# EAGLE design SWARMESH04 (EAGLE 9.2.0)
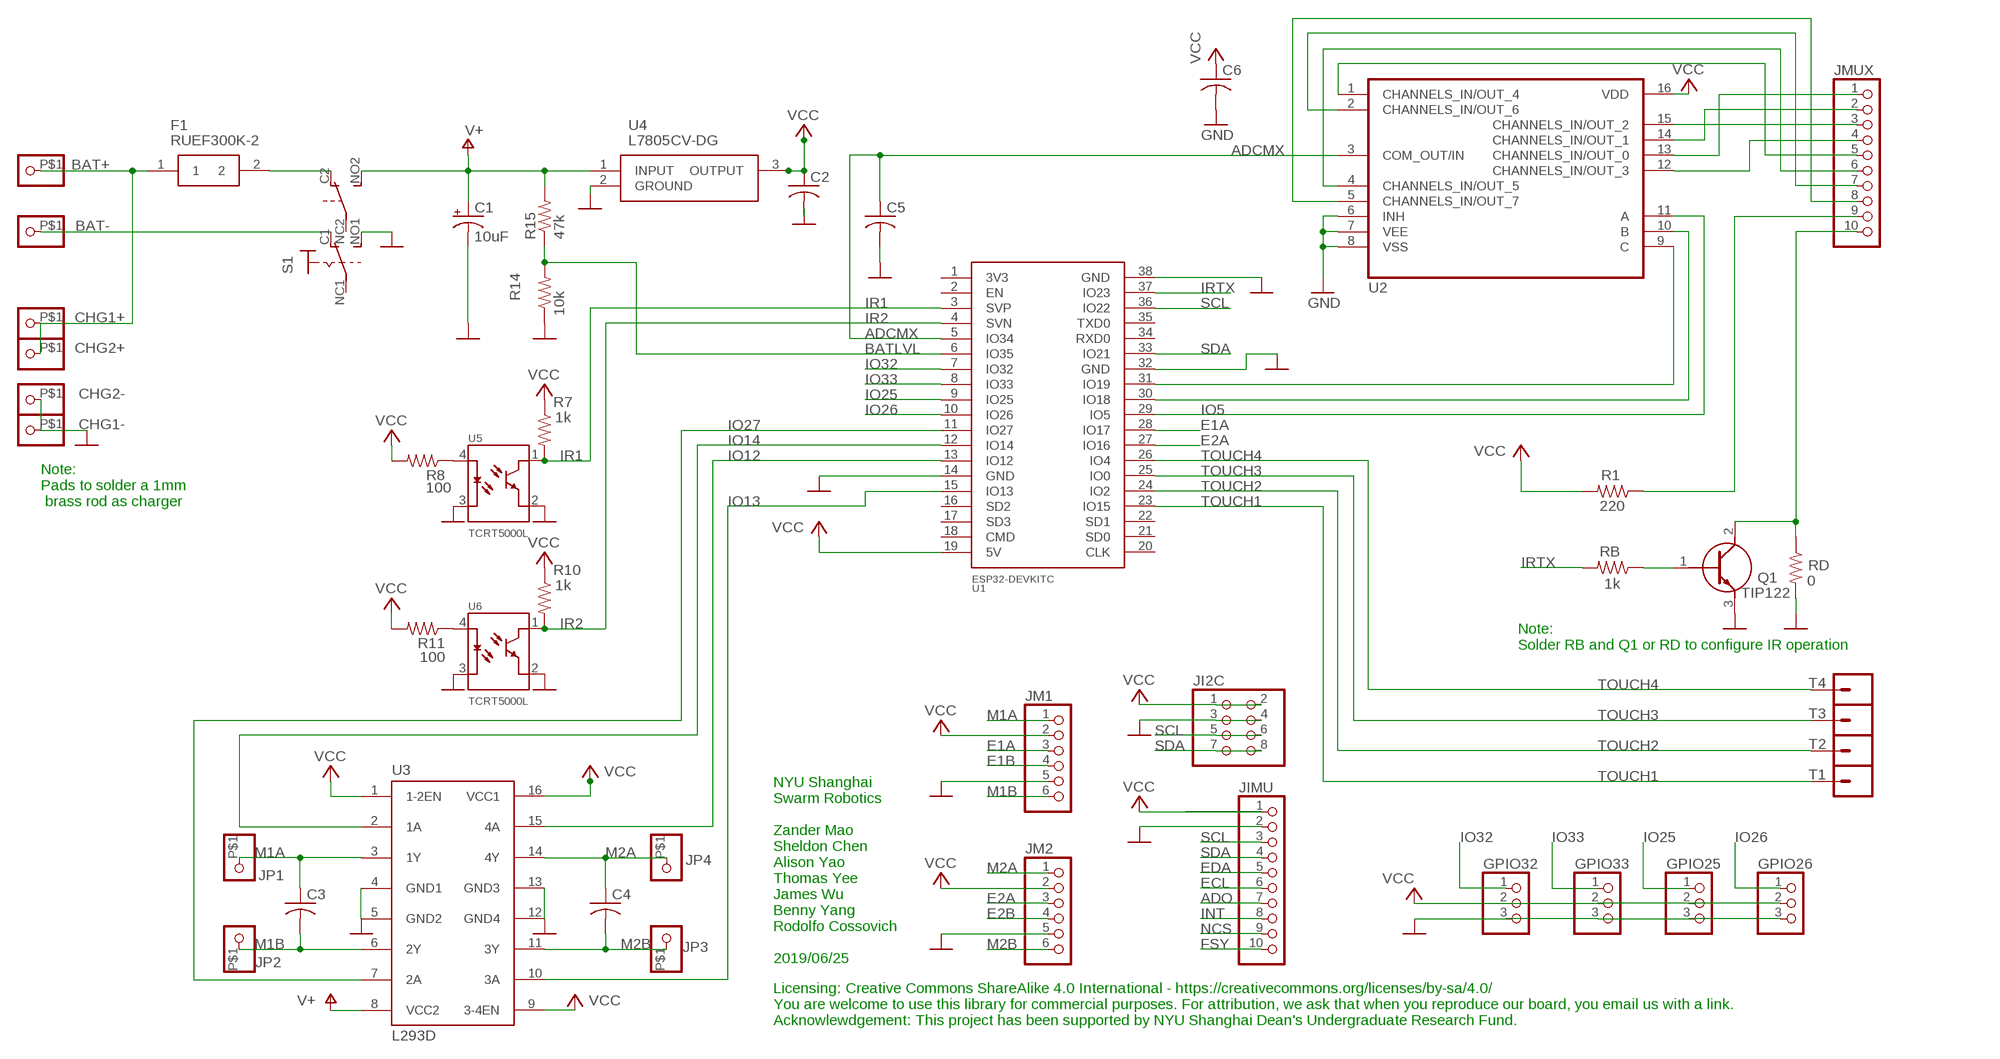
[diagram p0: schematic, sheet 1]

## Parts
BAT+  PINHD-1X1-BIGPOGO  [1X1-BIGPOGO]
BAT-  PINHD-1X1-BIGPOGO  [1X1-BIGPOGO]
C1  10uF  CPOL-USE2-5  [E2-5]
C2  C-US025-030X050  [C025-030X050]
C3  C-US025-025X050  [C025-025X050]
C4  C-US025-025X050  [C025-025X050]
C5  C-US025-030X050  [C025-030X050]
C6  C-US025-025X050  [C025-025X050]
CHG1+  PINHD-1X1-BIGPOGO  [1X1-BIGPOGO]
CHG1-  PINHD-1X1-BIGPOGO  [1X1-BIGPOGO]
CHG2+  PINHD-1X1-BIGPOGO  [1X1-BIGPOGO]
CHG2-  PINHD-1X1-BIGPOGO  [1X1-BIGPOGO]
F1  RUEF300K-2  [RUEF300K2]
GPIO25  PINHD-1X3  [1X03]
GPIO26  PINHD-1X3  [1X03]
GPIO32  PINHD-1X3  [1X03]
GPIO33  PINHD-1X3  [1X03]
JI2C  PINHD-2X4  [2X04]
JIMU  PINHD-1X10  [1X10-BIG]
JM1  PINHD-1X6  [1X06]
JM2  PINHD-1X6  [1X06]
JMUX  PINHD-1X10  [1X10-BIG]
JP1  PINHD-1X1-BIGPOGO  [1X1-BIGPOGO]
JP2  PINHD-1X1-BIGPOGO  [1X1-BIGPOGO]
JP3  PINHD-1X1-BIGPOGO  [1X1-BIGPOGO]
JP4  PINHD-1X1-BIGPOGO  [1X1-BIGPOGO]
Q1  TIP122  [TO270P460X1020X2008-3P]
R1  220  R-US_0207/9  [0207/9]
R7  1k  R-US_0207/9  [0207/9]
R8  100  R-US_0207/9  [0207/9]
R10  1k  R-US_0207/9  [0207/9]
R11  100  R-US_0207/9  [0207/9]
R14  10k  R-US_0207/9  [0207/9]
R15  47k  R-US_0207/9  [0207/9]
RB  1k  R-US_0207/9  [0207/9]
RD  0  R-US_0207/9  [0207/9]
S1  SWITCH_320-938  [PS22F03]
T1  CONN_01SPRING-CONN  [SPRING-CONNECTOR]
T2  CONN_01SPRING-CONN  [SPRING-CONNECTOR]
T3  CONN_01SPRING-CONN  [SPRING-CONNECTOR]
T4  CONN_01SPRING-CONN  [SPRING-CONNECTOR]
U1  ESP32DEVKITC  [ESP32-DEVKITC]
U2  CD4051BEE4  [CD4051BEE4DIP]
U3  L293D  [DIL16]
U4  L7805CV-DG  [TO270P460X1020X2008-3P]
U5  TCRT5000L  [XDCR_TCRT5000L]
U6  TCRT5000L  [XDCR_TCRT5000L]

## Nets
ADCMX: C5.1 U1.5(IO34) U2.3(COM_OUT/IN)
ADO: JIMU.7
BATLVL: R14.2 R15.1 U1.6(IO35)
E1A: JM1.3 U1.28(IO17)
E1B: JM1.4
E2A: JM2.3 U1.27(IO16)
E2B: JM2.4
ECL: JIMU.6
EDA: JIMU.5
FSY: JIMU.10
GND: C1.- C2.2 C5.2 C6.2 CHG1-.P$1 CHG2-.P$1 GPIO25.3 GPIO26.3 GPIO32.3 GPIO33.3 JI2C.3 JI2C.4 JIMU.2 JM1.5 JM2.5 Q1.3(E) R14.1 RD.2 S1.NO1(1:S) U1.14(GND) U1.32(GND) U1.38(GND) U2.6(INH) U2.7(VEE) U2.8(VSS) U3.4(GND1) U3.5(GND2) U3.12(GND4) U3.13(GND3) U4.2(GROUND) U5.2(E) U5.3(C) U6.2(E) U6.3(C)
INT: JIMU.8
IO5: U1.29(IO5) U2.11(A)
IO12: U1.13(IO12) U3.15(4A)
IO13: U1.15(IO13) U3.10(3A)
IO14: U1.12(IO14) U3.2(1A)
IO25: GPIO25.1 U1.9(IO25)
IO26: GPIO26.1 U1.10(IO26)
IO27: U1.11(IO27) U3.7(2A)
IO32: GPIO32.1 U1.7(IO32)
IO33: GPIO33.1 U1.8(IO33)
IR1: R7.2 U1.3(SVP) U5.1(CO)
IR2: R10.2 U1.4(SVN) U6.1(CO)
IRTX: RB.2 U1.37(IO23)
M1A: C3.1 JM1.1 JP1.P$1 U3.3(1Y)
M1B: C3.2 JM1.6 JP2.P$1 U3.6(2Y)
M2A: C4.1 JM2.1 JP4.P$1 U3.14(4Y)
M2B: C4.2 JM2.6 JP3.P$1 U3.11(3Y)
N$1: Q1.1(B) RB.1
N$2: F1.2 S1.C2(B:O)
N$3: BAT-.P$1 S1.C1(1:O)
N$5: JMUX.6 U2.4(CHANNELS_IN/OUT_5)
N$7: U1.30(IO18) U2.10(B)
N$8: U1.31(IO19) U2.9(C)
N$9: R11.1 U6.4(A)
N$10: R8.1 U5.4(A)
N$11: JMUX.5 U2.1(CHANNELS_IN/OUT_4)
N$13: JMUX.7 U2.2(CHANNELS_IN/OUT_6)
N$14: JMUX.8 U2.5(CHANNELS_IN/OUT_7)
N$15: BAT+.P$1 CHG1+.P$1 CHG2+.P$1 F1.1
N$16: JMUX.9 R1.1
N$17: JMUX.10 Q1.2(C) RD.1
N$19: JMUX.1 U2.13(CHANNELS_IN/OUT_0)
N$20: JMUX.2 U2.14(CHANNELS_IN/OUT_1)
N$21: JMUX.4 U2.12(CHANNELS_IN/OUT_3)
N$22: JMUX.3 U2.15(CHANNELS_IN/OUT_2)
NCS: JIMU.9
SCL: JI2C.5 JI2C.6 JIMU.3 U1.36(IO22)
SDA: JI2C.7 JI2C.8 JIMU.4 U1.33(IO21)
TOUCH1: T1.P$2 U1.23(IO15)
TOUCH2: T2.P$2 U1.24(IO2)
TOUCH3: T3.P$2 U1.25(IO0)
TOUCH4: T4.P$2 U1.26(IO4)
V+: C1.+ R15.2 S1.NO2(B:S) U3.8(VCC2) U4.1(INPUT)
VCC: C2.1 C6.1 GPIO25.2 GPIO26.2 GPIO32.2 GPIO33.2 JI2C.1 JI2C.2 JIMU.1 JM1.2 JM2.2 R1.2 R7.1 R8.2 R10.1 R11.2 U1.19(5V) U2.16(VDD) U3.1(1-2EN) U3.9(3-4EN) U3.16(VCC1) U4.3(OUTPUT)
Unconnected: S1.NC1(1:P) S1.NC2(B:P) U1.1(3V3) U1.2(EN) U1.16(SD2) U1.17(SD3) U1.18(CMD) U1.20(CLK) U1.21(SD0) U1.22(SD1) U1.34(RXD0) U1.35(TXD0)

## Notes on the sheet
- Note:
  Pads to solder a 1mm
   brass rod as charger
- Note:
  Solder RB and Q1 or RD to configure IR operation
- NYU Shanghai
  Swarm Robotics
  
  Zander Mao
  Sheldon Chen
  Alison Yao
  Thomas Yee
  James Wu
  Benny Yang
  Rodolfo Cossovich
  
  2019/06/25
- Licensing: Creative Commons ShareAlike 4.0 International - https://creativecommons.org/licenses/by-sa/4.0/ 
  You are welcome to use this library for commercial purposes. For attribution, we ask that when you reproduce our board, you email us with a link.
  Acknowlewdgement: This project has been supported by NYU Shanghai Dean's Undergraduate Research Fund.

## Library data of the parts
BAT+ BAT- CHG1+ CHG1- CHG2+ CHG2- JP1-JP4 = adafruit:PINHD-1X1: Pin header 1x1 for 0.1" spacing With round pins
C1 = adafruit:CPOL-US: POLARIZED CAPACITOR, American symbol
C2-C6 = adafruit:C-US: CAPACITOR, American symbol
F1 = RUEF300K-2:RUEF300K-2: TE CONNECTIVITY / RAYCHEM - RUEF300K-2 - RESETTABLE FUSE, PTC, 30V, 3A, RADIAL Source: Datasheet <http://www.farnell.com/datasheets/1482689.pdf>; DESCRIPTION: TE CONNECTIVITY / RAYCHEM - RUEF300K-2 - RESETTABLE FUSE, PTC, 30V, 3A, RADIAL; HEIGHT: 16.5mm; MANUFACTURER_NAME: TE CONNECTIVITY / RAYCHEM; MANUFACTURER_PART_NUMBER: RUEF300K-2
GPIO25 GPIO26 GPIO32 GPIO33 = adafruit:PINHD-1X3: PIN HEADER
JI2C = adafruit:PINHD-2X4: PIN HEADER
JIMU JMUX = adafruit:PINHD-1X10: Pin header 1x10 0.1" spacing With round pins
JM1 JM2 = adafruit:PINHD-1X6: PIN HEADER
Q1 = TIP122:TIP122: TIP122, Darlington Transistor, NPN 8 A 100 V HFE:1000, 3-Pin, TO-220 Source: Datasheet <https://componentsearchengine.com/Datasheets/1/TIP122.pdf>; DESCRIPTION: TIP122, Darlington Transistor, NPN 8 A 100 V HFE:1000, 3-Pin, TO-220; HEIGHT: 4.6mm; MANUFACTURER_NAME: STMicroelectronics; MANUFACTURER_PART_NUMBER: TIP122; MOUSER_PART_NUMBER: 511-TIP122; MOUSER_PRICE-STOCK: https://www.mouser.com/Search/Refine.aspx?Keyword=511-TIP122
R1 R7 R8 R10 R11 R14 R15 RB RD = adafruit:R-US_: RESISTOR, American symbol
S1 = ArduinoNano LearningBot 4-21-18:SWITCH_320-938: TOGGLE SWITCH distributor RS Components
T1-T4 = SparkFun-Connectors:CONN_01: Single connection point. Often used as Generic Header-pin footprint for 0.1 inch spaced/style header connections On any of the 0.1 inch spaced packages, you can populate with these: Break Away Headers - Straight <https://www.sparkfun.com/products/116> (PRT-00116) Break Away Male Headers - Right Angle <https://www.sparkfun.com/products/553> (PRT-00553) Female Headers <https://www.sparkfun.com/products/115> (PRT-00115) Break Away Headers - Machine Pin <https://www.sparkfun.com/products/117> (PRT-00117) Break Away Female Headers - Swiss Machine Pin <https://www.sparkfun.com/products/743> (PRT-00743) This device is also useful as a general connection point to wire up your design to another part of your project. Our various solder wires solder well into these plated through hole pads. Hook-Up Wire - Assortment (Stranded, 22 AWG) <https://www.sparkfun.com/products/11375> (PRT-11375) Hook-Up Wire - Assortment (Solid Core, 22 AWG) <https://www.sparkfun.com/products/11367> (PRT-11367) View the entire wire category on our website here <https://www.sparkfun.com/categories/141> Special notes: SMTSO-256-ET is a "flush mount" nut for a 4-40 screw. We mostly use this on specialty testbeds; it is a nice way to connect hardware to your PCB at an adjustable hieght. Also note, the SNAP packages are for using a snappable style connector. We sell a baggie of snaps and they are also used on two LilyPad designs: Snap Assortment - 30 pack (male and female) <https://www.sparkfun.com/products/11347> (DEV-11347) LilyPad Arduino SimpleSnap <https://www.sparkfun.com/products/10941> (DEV-10941) LilyPad SimpleSnap Protoboard <https://www.sparkfun.com/products/10940> (DEV-10940); SF_ID: PRT-11822
U1 = ESP32-DEVKITC (1):ESP32DEVKITC
U2 = CD4051BEE4:CD4051BEE4: Multiplexer 8pin ADC/DAC
U3 = st-microelectronics:L293D: PUSH-PULL 4 CHANNEL DRIVER; MPN: L293D; OC_FARNELL: 9589619; OC_NEWARK: 56P8249
U4 = L7805CV-DG:L7805CV-DG: Voltage Regulator 5V 4% 1.5A TO220 L7805CV-DG, Linear Voltage Regulator, Current Limit, Shut-Down 1.5A 5 V, 3-Pin TO220 Source: Datasheet <http://www.st.com/web/en/resource/technical/document/datasheet/CD00000444.pdf>; ALLIED_NUMBER: 70390055; ALLIED_PRICE-STOCK: http://www.alliedelec.com/stmicroelectronics-l7805cv-dg/70390055/; DESCRIPTION: Voltage Regulator 5V 4% 1.5A TO220 L7805CV-DG, Linear Voltage Regulator, Current Limit, Shut-Down 1.5A 5 V, 3-Pin TO220; HEIGHT: 4.6mm; MANUFACTURER_NAME: STMicroelectronics; MANUFACTURER_PART_NUMBER: L7805CV-DG; MOUSER_PART_NUMBER: 511-L7805CV-DG; MOUSER_PRICE-STOCK: https://www.mouser.com/Search/Refine.aspx?Keyword=511-L7805CV-DG; RS_PART_NUMBER: 7931346P; RS_PRICE-STOCK: http://uk.rs-online.com/web/p/products/7931346P
U5 U6 = TCRT5000L:TCRT5000L: TCRT5000 Series 940 nm 100 mA 60 mA Transistor Output Reflective Optical Sensor; AVAILABILITY: Unavailable; DESCRIPTION: TCRT5000 Series 940 nm 100 mA 60 mA Transistor Output Reflective Optical Sensor; MF: Vishay Semiconductor; MP: TCRT5000L; PACKAGE: PCB Mount Vishay; PRICE: None

## Board
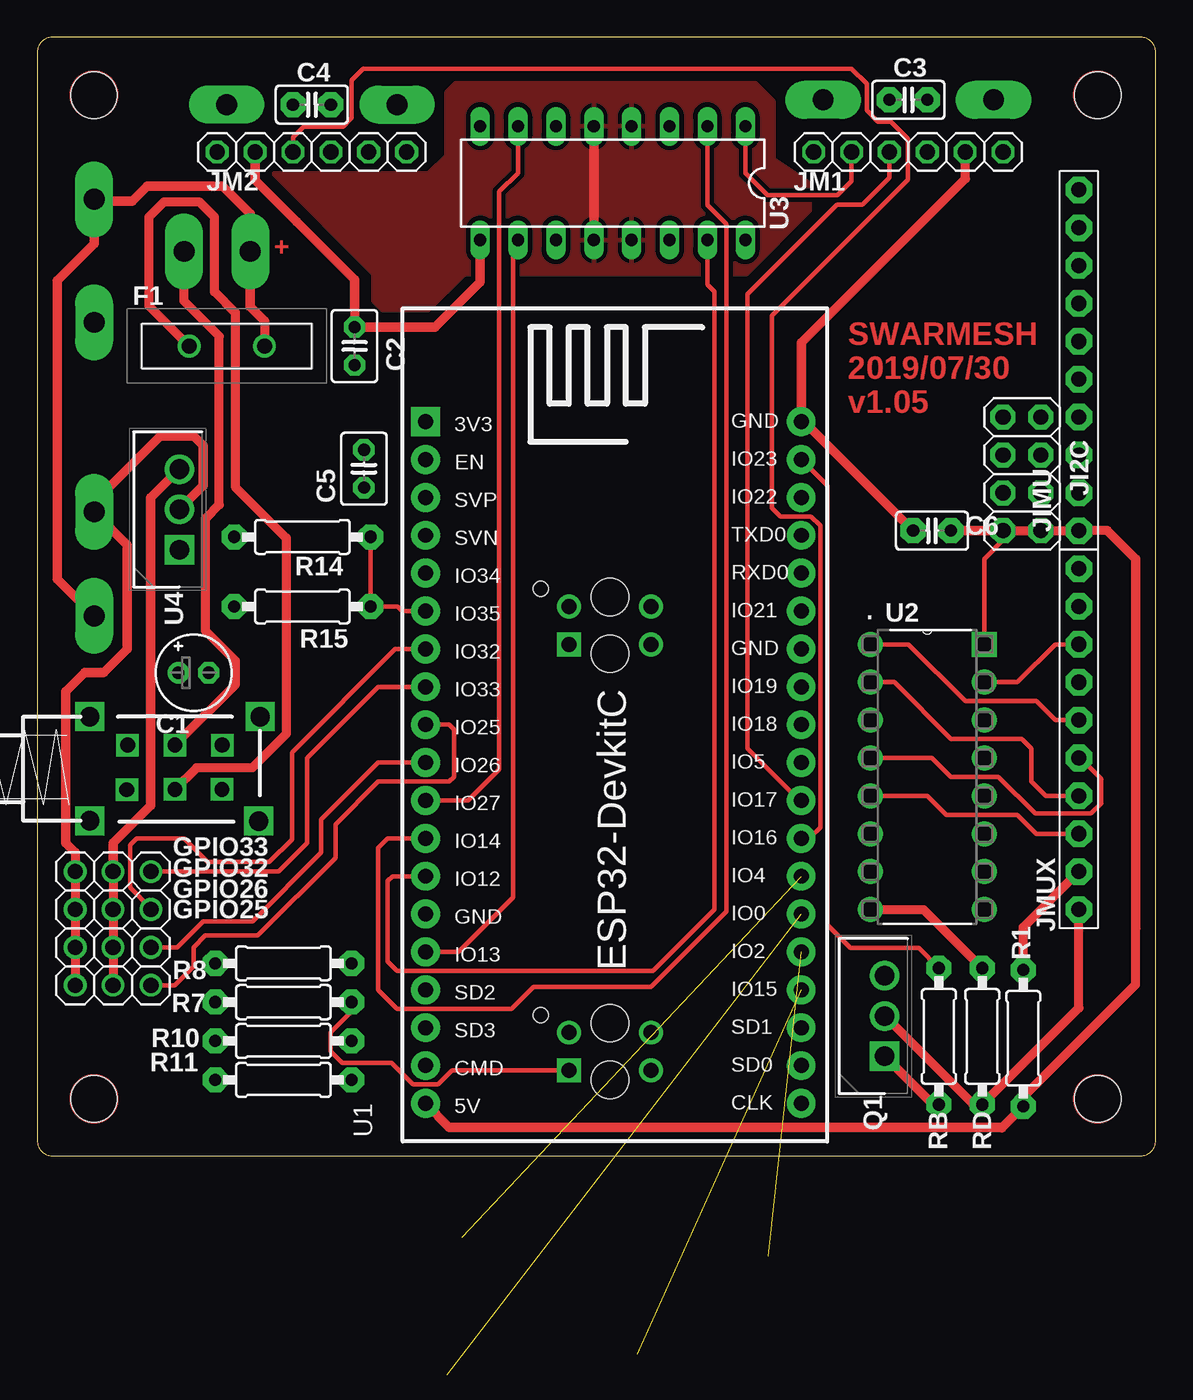
[diagram p1: board, top side]
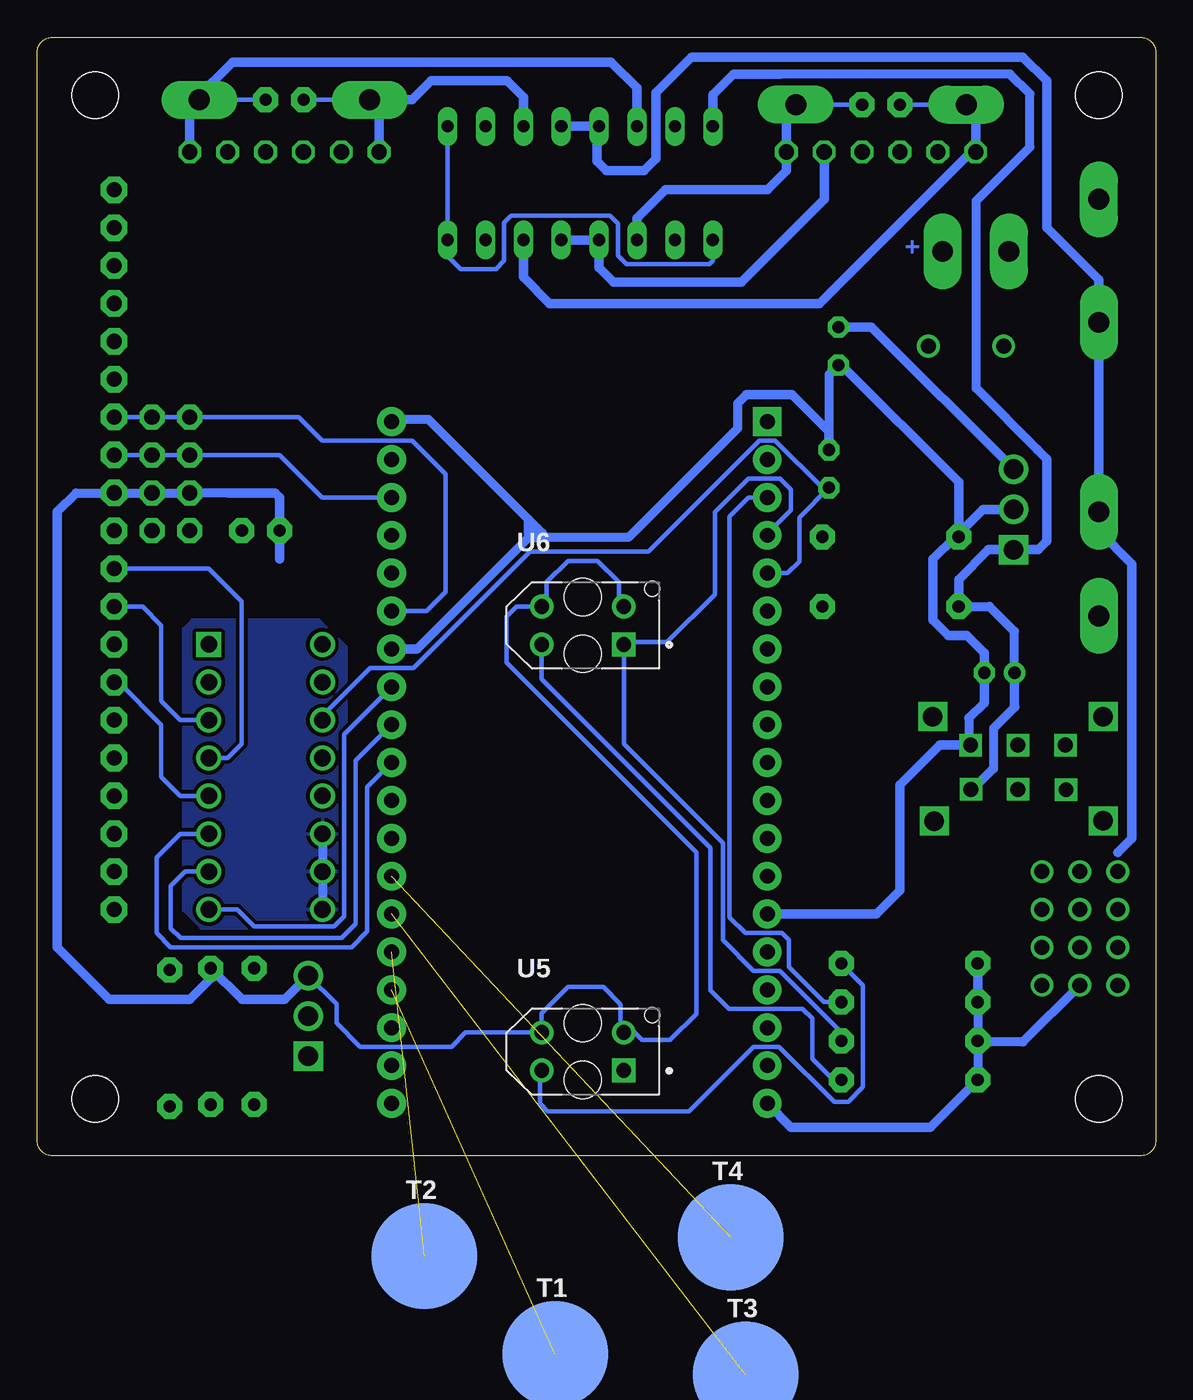
[diagram p2: board, bottom side, seen from below]

Size 75 x 75 mm. Coordinates in mm from the lower left corner, seen from the top.
Outline: 0,74 0,1 arc90 1,0 74,0 arc90 75,1 75,74 arc90 74,75 1,75 arc90 0,74
Copper layers (1*16): Top 0.035mm / dielectric 1.5mm / Bottom 0.035mm
Design rules "default *": minimum track width 6mil, minimum drill 0.35mm, track to track 6mil, track to pad 6mil, pad to pad 6mil, via to via 6mil, smd to smd 6mil, copper to edge 40mil, drill to drill 6mil, minimum pad ring 10mil, minimum via ring 8mil, stop-mask expansion 4mil, vias tented up to drill 0mil, thermal gap 10mil
Holes 3.1 mm at 3.81,3.81 3.81,71.12 71.12,71.12 71.12,3.81
tKeepout: area 0.9,0.9 to 6.7,6.7; area 68.3,1 to 74,6.6; area 0.9,68.2 to 6.7,74; area 68.2,68.2 to 74,74

### Footprints (pad centres in the part's own frame; a part is rotated, then mirrored left to right if it is on the bottom)
1X1-BIGPOGO = drill 1.4 pad 2.54 long: P$1 0,0
E2-5 = drill 0.813 pad 1.422: + -1.016,0 | drill 0.813 pad 1.422 octagon: - 1.016,0
C025-030X050 = drill 0.813 pad 1.422 octagon: 1 -1.27,0; 2 1.27,0
C025-025X050 = drill 0.813 pad 1.676 octagon: 1 -1.27,0; 2 1.27,0
RUEF300K2 = drill 1.01 pad 1.515: 1 0,0; 2 5.05,0
1X03 = drill 1.016: 1 -2.54,0; 2 0,0; 3 2.54,0
2X04 = drill 1.016 pad 1.676 octagon: 1 -3.81,-1.27; 2 -3.81,1.27; 3 -1.27,-1.27; 4 -1.27,1.27; 5 1.27,-1.27; 6 1.27,1.27; 7 3.81,-1.27; 8 3.81,1.27
1X10-BIG = drill 1.016 pad 1.778 octagon: 1 -11.43,0; 2 -8.89,0; 3 -6.35,0; 4 -3.81,0; 5 -1.27,0; 6 1.27,0; 7 3.81,0; 8 6.35,0; 9 8.89,0; 10 11.43,0
1X06 = drill 1.016 octagon: 1 -6.35,0; 2 -3.81,0; 3 -1.27,0; 4 1.27,0; 5 3.81,0; 6 6.35,0
TO270P460X1020X2008-3P = drill 1.32 pad 1.98 square: 1 0,0 | drill 1.32 pad 1.98: 2 2.7,0; 3 5.4,0
0207/9 = drill 0.813 pad 1.676 octagon: 1 -4.572,0; 2 4.572,0
PS22F03 = drill 1.3 square: 0 -3.175,5.715; 1 3.835,5.613; 2 3.81,-5.715; 3 -3.175,-5.715 | drill 1 square: C1 -1.27,0; C2 1.702,0; NC1 -1.27,-3.175; NC2 1.727,-3.226; NO1 -1.27,3.175; NO2 1.702,3.15
SPRING-CONNECTOR = smd 7.112 x 7.112: P$2 0,0
ESP32-DEVKITC = drill 1 pad 1.93 square: 1 -0.01,0.01 | drill 1 pad 1.93: 2 2.53,0.01; 3 5.07,0.01; 4 7.61,0.01; 5 10.15,0.01; 6 12.69,0.01; 7 15.23,0.01; 8 17.77,0.01; 9 20.31,0.01; 10 22.85,0.01; 11 25.39,0.01; 12 27.93,0.01; 13 30.47,0.01; 14 33.01,0.01; 15 35.55,0.01; 16 38.09,0.01; 17 40.63,0.01; 18 43.17,0.01; 19 45.71,0.01; 20 45.71,25.2; 21 43.17,25.2; 22 40.63,25.2; 23 38.09,25.2; 24 35.55,25.2; 25 33.01,25.2; 26 30.47,25.2; 27 27.93,25.2; 28 25.39,25.2; 29 22.85,25.2; 30 20.31,25.2; 31 17.77,25.2; 32 15.23,25.2; 33 12.69,25.2; 34 10.15,25.2; 35 7.61,25.2; 36 5.07,25.2; 37 2.53,25.2; 38 -0.01,25.2
CD4051BEE4DIP = drill 1.118: 1 -3.81,8.89; 2 -3.81,6.35; 3 -3.81,3.81; 4 -3.81,1.27; 5 -3.81,-1.27; 6 -3.81,-3.81; 7 -3.81,-6.35; 8 -3.81,-8.89; 9 3.81,-8.89; 10 3.81,-6.35; 11 3.81,-3.81; 12 3.81,-1.27; 13 3.81,1.27; 14 3.81,3.81; 15 3.81,6.35 | drill 1.118 square: 16 3.81,8.89
DIL16 = drill 0.813 long: 1 -8.89,-3.81; 2 -6.35,-3.81; 3 -3.81,-3.81; 4 -1.27,-3.81; 5 1.27,-3.81; 6 3.81,-3.81; 7 6.35,-3.81; 8 8.89,-3.81; 9 8.89,3.81; 10 6.35,3.81; 11 3.81,3.81; 12 1.27,3.81; 13 -1.27,3.81; 14 -3.81,3.81; 15 -6.35,3.81; 16 -8.89,3.81
XDCR_TCRT5000L = drill 1 pad 1.6 square: 1 -2.75,1.27 | drill 1 pad 1.6: 2 -2.75,-1.27; 3 2.75,-1.27; 4 2.75,1.27 | hole 2.5: 0,1.9; 0,-1.9 | hole 1: -4.65,-2.45

### Placement (x,y rotation side)
BAT+  3.81,64.14 90 top
BAT-  9.84,60.64 90 top
C1  10.48,32.38 0 top
C2  21.27,54.29 270 top
C3  58.42,70.8 0 top
C4  18.41,70.48 0 top
C5  21.91,46.06 90 top
C6  60.01,41.91 180 top
CHG1+  3.81,36.2 270 top
CHG1-  3.81,43.18 270 top
CHG2+  14.29,60.64 270 bottom
CHG2-  3.81,55.88 270 top
F1  15.24,54.29 180 top
GPIO25  5.08,11.43 180 top
GPIO26  5.08,13.97 180 top
GPIO32  5.08,16.51 180 top
GPIO33  5.08,19.05 180 top
JI2C  66.04,45.72 90 top
JIMU  69.85,53.34 90 top
JM1  58.42,67.31 0 top
JM2  18.41,67.31 0 top
JMUX  69.85,27.94 270 top
JP1  52.7,70.8 180 top
JP2  64.14,70.8 180 top
JP3  24.13,70.48 0 top
JP4  12.7,70.48 180 top
Q1  56.83,6.67 90 top
R1  66.12,7.88 270 top
R7  16.51,10.3 0 top
R8  16.51,12.9 180 top
R10  16.51,7.69 0 top
R11  16.51,5.08 180 top
R14  17.78,41.5 0 top
R15  17.78,36.83 180 top
RB  60.46,8 90 top
RD  63.37,8 90 top
S1  9.23,26.27 270 top
T1  40.27,-13.31 0 bottom  (outside the outline)
T2  49.03,-6.74 0 bottom  (outside the outline)
T3  27.49,-14.68 0 bottom  (outside the outline)
T4  28.49,-5.47 0 bottom  (outside the outline)
U1  26.04,49.21 270 top
U2  59.69,25.4 0 top
U3  38.59,65.22 180 top
U4  9.53,40.64 90 top
U5  38.42,6.99 180 bottom
U6  38.42,35.56 180 bottom

### Tracks (layer width: path | path; a pad name or v marks a point on that pad's centre or on a via)
ADCMX
  Bottom 0.305: U2.3 55.88,29.53 52.7,32.71 49.76,32.71 41.94,40.53 34,40.53 26.57,47.95 25.52,47.95 22.36,44.79 C5.1 23.9,42.8 23.9,39.85 24.69,39.06 U1.5
BATLVL
  Top 0.305: R14.2 R15.1 24.15,36.83 24.46,36.52 U1.6
E1A
  Top 0.305: U1.28 51.12,23.82 47.62,27.32 47.62,57.78 53.62,63.78 55.35,63.78 57.15,65.58 JM1.3
E2A
  Top 0.305: U1.27 51.29,21.34 51.83,21.34 52.52,22.02 52.52,42.24 51.89,42.87 49.84,42.87 49.28,43.43 49.28,56.34 58.4,65.46 58.4,68.21 57.26,69.34 56.39,69.34 55.63,70.1 55.63,71.88 54.61,72.9 21.84,72.9 21.08,72.14 21.08,69.6 20.5,69.01 17.86,69.01 17.14,68.3 JM2.3
GND
  Top 0.305: 41.15,36.84 U6.3 | 35.68,36.84 U6.2
  Top 0.61: C6.2 51.42,49.22 U1.38 | 62.23,65.53 JM1.5 | U2.8 59.43,16.51 RD.2 | 2.54,20.32 GPIO33.3 GPIO32.3 GPIO26.3 GPIO25.3
  Top 0.635: U3.5 U3.12 | U4.2 11.11,44.93 11.11,47.62 10.48,48.26 8.26,48.26 3.81,43.81 CHG1-.P$1 6.03,40.96 6.03,33.97 4.45,32.38 3.17,32.38 1.91,31.11 1.91,20.95 2.54,20.32 | U1.38 51.23,54.54 62.23,65.53
  Bottom 0.305: 41.15,8.3 41.23,8.3 41.27,8.26 | U5.2 35.68,8.27 | U5.2 36,8.59 | U6.2 36,37.16 36,38.46 37.42,39.88 39.42,39.88 40.84,38.46 40.84,37.16 U6.3 42.86,36.83 43.54,36.15 43.54,33.06 30.8,20.32 30.8,9.53 32.56,7.77 34.46,7.77 34.95,8.26 U5.2 | 56.82,12.07 Q1.3 54.93,10.16 54.93,8.89 53.35,7.31 47.22,7.31 46.27,8.26 41.27,8.26 | 41.27,8.26 U5.3 41.17,9.55 39.42,11.3 37.02,11.3 35.88,10.16 35.88,8.46 U5.2
  Bottom 0.61: S1.NO1 12.51,27.64 12.51,29.34 | 14.92,35.92 13.89,34.9 | C1.- 11.49,32.5 | 72.39,44.45 JIMU.2 JI2C.3 JI2C.4 62.23,44.45 | U2.6 U2.7 U2.8 | C2.2 21.91,52.39 C5.2 | 27.43,51.05 28.04,50.44 28.04,48.77 35.36,41.45 40.84,41.45 41.15,41.76 42.06,42.67 48.77,49.38 51.08,49.38 U1.38
  Bottom 0.635: Q1.3 58.42,10.48 61.27,10.48 RD.2 63.37,11.88 64.77,10.48 70.17,10.48 73.66,13.97 73.66,43.18 72.39,44.45 | U1.14 18.74,16.2 17.14,17.8 17.14,24.87 14.47,27.54 S1.NO1 | U3.4 37.47,69.03 | 37.47,69.03 U3.5 | U3.13 U3.12 37.32,59.55 36.35,58.57 27.79,58.57 22.23,64.14 JM2.5 | U4.2 11.59,43.34 13.21,41.72 R14.1 | 14.92,35.92 14.92,40.01 13.43,41.5 R14.1 | 2.54,20.32 1.59,21.27 1.59,39.69 3.81,41.91 CHG1-.P$1 CHG2-.P$1 3.81,58.74 7.3,62.23 7.3,72.07 8.89,73.66 31.11,73.66 33.5,71.27 33.5,66.85 34.31,66.04 36.83,66.04 37.47,66.67 37.47,69.03 | 12.51,29.34 11.49,30.35 C1.- 11.49,33.69 12.68,34.87 13.87,34.87 13.89,34.9 | R14.1 13.21,45.16 21.07,53.02 C2.2 | 58.74,40.01 C6.2 58.74,44.13 59.05,44.45 62.23,44.45 | C5.2 21.91,48.55 24.41,51.05 27.43,51.05 | 40.84,41.45 42.06,41.45 | U1.32 49.53,33.98 42.06,41.45 | 42.06,41.45 42.06,42.06 | 42.06,42.06 42.06,42.67 | 41.15,41.76 41.45,42.06 42.06,42.06
  pour Top (isolate 0.305): 49.38,66.85 49.38,70.71 48.16,71.93 28.04,71.93 27.43,71.32 27.43,67.06 26.21,65.84 15.85,65.84 22.56,59.13 22.56,57.3 23.16,56.69 26.21,56.69 28.65,59.13 47.55,59.13 51.82,63.4 51.82,65.23
  pour Bottom (isolate 0.254): 56.08,35.97 54.25,34.14 54.25,15.85 54.86,15.24 64.01,15.24 65.23,16.46 65.23,35.36 64.62,35.97
IO5
  Bottom 0.305: U1.29 52.87,24.73 52.87,15.02 53.92,13.97 66.04,13.97 66.99,14.92 66.99,20 65.41,21.59 U2.11
IO12
  Top 0.305: U3.15 44.94,58.42 45.4,57.96 45.4,16.51 41.27,12.38 26.58,12.38 26.57,12.39 25.52,12.39 25.51,12.38 24.13,12.38 23.5,13.02 23.5,18.41 23.81,18.73 26.04,18.73 U1.13
IO13
  Top 0.305: U3.10 31.92,61.09 31.92,17.32 28.27,13.66 U1.15
IO14
  Top 0.305: U3.2 44.94,63.75 46.22,62.47 46.22,16.38 41.15,11.3 33.28,11.3 31.82,9.84 26.58,9.84 26.57,9.85 25.52,9.85 25.51,9.84 24.13,9.84 22.86,11.11 22.86,20.64 23.5,21.28 U1.12 25.99,21.34
IO25
  Top 0.305: GPIO25.1 9.21,11.43 10.48,12.7 10.48,13.97 11.27,14.76 14.79,14.76 20,19.98 20,22.23 22.87,25.09 27.63,25.09 27.94,25.4 27.94,28.57 27.61,28.9 U1.9
IO26
  Top 0.305: U1.10 22.87,26.36 19.05,22.54 19.05,20.32 14.45,15.72 11.11,15.72 9.37,13.97 GPIO26.1
IO27
  Top 0.305: U3.7 32.24,65.89 30.98,64.63 30.98,25.89 28.9,23.82 U1.11
IO32
  Top 0.305: GPIO32.1 7.62,16.59 6.24,17.97 6.24,20.84 6.67,21.27 9.84,21.27 11.43,19.68 15.56,19.68 17.08,21.21 17.08,27.05 24.01,33.98 U1.7
IO33
  Top 0.305: U1.8 22.87,31.44 18.1,26.67 18.1,20.95 16.19,19.05 GPIO33.1
IR1
  Top 0.305: R7.2 21.08,9.66 19.68,8.26 19.68,6.99 20.44,6.22 23.75,6.22 25.2,4.77 26.89,4.77 27.83,5.71 U5.1
  Bottom 0.305: 21.08,10.5 R7.2 22.23,10.3 24.59,12.65 24.59,14.45 25.07,14.93 27.52,14.93 28.57,15.98 28.57,42.86 27.3,44.14 U1.3
IR2
  Bottom 0.305: R10.2 21.08,8.27 25.2,12.39 26.96,12.39 29.03,14.47 29.03,20.99 35.67,27.62 U6.1 35.52,34.44 32.76,34.44 29.56,37.64 29.56,43.16 27.31,45.41 25.2,45.41 24.46,44.67 24.46,43.3 26.05,41.71 U1.4
IRTX
  Top 0.305: U1.37 52.98,44.94 52.98,15.49 54.54,13.92 59.11,13.92 RB.2
M1A
  Bottom 0.305: C3.1 JP1.P$1
  Bottom 0.635: JM1.1 52.07,70.17 JP1.P$1 49.85,70.8 48.58,72.07 43.5,72.07 42.4,70.97 U3.3
M1B
  Bottom 0.305: 64.45,70.8 C3.2
  Bottom 0.635: U3.6 34.78,71.61 36.51,73.34 61.91,73.34 64.45,70.8 JP2.P$1 64.77,70.17 JM1.6
M2A
  Bottom 0.305: C4.1 JP4.P$1
  Bottom 0.635: JP4.P$1 12.06,69.85 JM2.1 12.38,67.31 22.54,57.15 40.64,57.15 42.4,58.91 U3.14
M2B
  Bottom 0.305: JP3.P$1 C4.2
  Bottom 0.635: 25.08,67.63 JM2.6 | U3.11 34.78,62.87 32.88,64.77 26.04,64.77 24.77,66.04 JM2.6 | JM2.6 24.77,69.85 JP3.P$1
N$1
  Top 0.61: RB.1 60.07,3.43 Q1.1
N$2
  Top 0.61: F1.2 7.48,56.99 7.48,62.95 8.49,63.96 10.88,63.96 11.89,62.95 11.89,57.93 13.28,56.54 13.28,44.84 16.7,41.43 16.7,28.28 14.43,26.01 10.67,26.01 S1.C2
N$3
  Top 0.61: BAT-.P$1 9.84,57.31 12.21,54.95 12.21,43.65 11.29,42.74 11.29,35.19 13.3,33.19 13.3,31.61 S1.C1
N$5
  Top 0.305: 56.17,26.67 U2.4 60.01,26.67 61.28,25.4 64.45,25.4 66.92,22.94 70.66,22.94 71.36,23.64 71.36,25.26 69.95,26.67 JMUX.6
N$7
  Bottom 0.305: U1.30 53.65,26.49 53.65,15.53 54.58,14.59 65.39,14.59 66.04,15.24 66.04,18.1 65.09,19.05 U2.10
N$8
  Bottom 0.305: U1.31 54.42,28.26 54.42,16.04 55.09,15.37 60.45,15.37 61.59,16.51 U2.9
N$9
  Bottom 0.305: U6.4 41.17,31.96 29.84,20.64 29.84,11.1 28.6,9.85 26.62,9.85 26.6,9.83 26.59,9.83 26.57,9.85 23.67,9.85 23.01,9.2 23.01,6.48 21.61,5.08 R11.1
N$10
  Bottom 0.305: R8.1 21.08,12.87 19.62,11.4 19.62,4.61 20.61,3.62 21.55,3.62 25.25,7.31 26.96,7.31 31.29,2.98 40.77,2.98 41.27,3.49 41.27,5.61 U5.4
N$11
  Top 0.305: U2.1 58.42,34.29 62.23,30.48 66.99,30.48 68.26,29.21 JMUX.5
N$13
  Top 0.305: U2.2 57.47,31.75 61.28,27.94 66.04,27.94 66.67,27.3 66.67,25.08 67.63,24.13 JMUX.7
N$14
  Top 0.305: JMUX.8 66.99,21.59 65.72,22.86 60.96,22.86 59.69,24.13 U2.5 56.2,24.13
N$15
  Top 0.61: CHG2+.P$1 14.29,63.18 | 15.24,55.97 F1.1
  Top 0.635: CHG1+.P$1 1.33,38.67 1.33,58.67 3.81,61.15 BAT+.P$1 3.94,64.01 6.35,64.01 7.37,65.02 12.45,65.02 14.29,63.18 | CHG2+.P$1 14.29,56.93 15.24,55.97
N$16
  Top 0.61: R1.1 66.12,15.32 JMUX.9
N$17
  Top 0.61: JMUX.10 69.85,9.91 RD.1 62.77,3.43 Q1.2
N$19
  Bottom 0.305: JMUX.1 63.5,39.37 61.28,37.15 61.28,27.62 62.23,26.67 U2.13
N$20
  Bottom 0.305: JMUX.2 67.94,36.83 66.67,35.56 66.67,30.48 65.41,29.21 U2.14
N$21
  Bottom 0.305: JMUX.4 69.53,31.75 66.67,28.89 66.67,25.4 65.41,24.13 U2.12
N$22
  Top 0.305: U2.15 65.72,31.75 68.26,34.29 JMUX.3
SCL
  Bottom 0.305: JIMU.3 JI2C.5 JI2C.6 58.74,46.99 55.89,44.14 U1.36
SDA
  Bottom 0.305: JIMU.4 JI2C.7 JI2C.8 57.47,49.53 55.89,47.95 49.86,47.95 47.62,45.72 47.62,37.78 48.88,36.52 U1.33
TOUCH1  (1 unrouted)
TOUCH2  (1 unrouted)
TOUCH3  (1 unrouted)
TOUCH4  (1 unrouted)
V+
  Bottom 0.61: 7.93,47.37 12.03,51.47 12.03,64.03 8.43,67.63 8.43,71.2 9.76,72.53 25.15,72.53 26.2,72.53 | S1.NO2 12.32,24.51 10.88,25.96 10.88,28.66 9.44,30.1 | U4.1 9.21,40.64 | C1.+ 9.46,35.15 11.14,36.83 R15.2
  Bottom 0.635: 9.44,30.1 9.46,30.12 C1.+ | R15.2 13.21,38.63 11.2,40.64 U4.1 7.87,40.64 7.29,41.22 7.29,46.73 7.93,47.37 | 25.15,72.53 28.31,72.53 29.7,71.14 U3.8
VCC
  Top 0.305: U2.16 63.5,40.01 64.77,41.27 JI2C.2 | JM1.2 54.61,65.35 53.67,64.41 48.97,64.41 47.5,65.89 47.5,69.01 U3.1
  Top 0.61: 21.27,56.83 C2.1 | 65.8,3.62 73.66,11.48 73.66,16.19 | JI2C.2 JI2C.1 JIMU.1 71.75,41.91 | GPIO33.2 GPIO32.2 GPIO26.2 GPIO25.2
  Top 0.635: U4.3 7.62,44.13 7.62,23.5 5.08,20.95 GPIO33.2 | 65.8,3.62 R1.2 64.69,1.87 64.69,1.92 27.63,1.92 U1.19 | 73.66,15.24 73.66,16.19 73.66,40.01 71.75,41.91 | JI2C.2 C6.1 | U3.9 29.7,58.59 26.67,55.56 C2.1 | JM2.2 14.61,65.41 17.39,62.62 17.41,62.62 21.27,58.76 21.27,56.83
  Bottom 0.305: U3.1 U3.16 47.48,60.34 46.61,59.46 44.22,59.46 43.68,60 43.68,62.58 43.23,63.03 36.6,63.03 36.06,62.49 36.06,60.35 35.5,59.78 29.93,59.78 29.7,60.02 U3.9
  Bottom 0.61: R7.1 R10.1 11.94,7.62 | 11.94,7.62 R11.2 | GPIO25.2 8.89,7.62 11.94,7.62
  Bottom 0.635: C2.1 19.05,55.56 U4.3 | R10.1 11.62,7.37 | R8.2 R7.1 | U1.19 24.45,1.91 15.11,1.91 R11.2
(copper drawn outside any net)
  shapes: Top circle x4

### Text on the board
Top: + | SWARMESH / 2019/07/30 / v1.05
Bottom: +
Document: NYU Shanghai / Swarm Robotics / / Zander Mao / Sheldon Chen / Alison Yao / Thomas Yee / James Wu / Benny Yang / Rodolfo Cossovich / / 2019/07/30 | Licensing: Creative Commons ShareAlike 4.0 International - https://creativecommons.org/licenses/by-sa/4.0/ / You are welcome to use this library for commercial purposes. For attribution, we ask that when you reproduce our board, you email us with a link. / Acknowlewdgement: This project has been supported by NYU Shanghai Dean's Undergraduate Research Fund. | This IR reflective sensor should be standing in the front of the robot so we use it to detect obstacles. | Notes: tip122 and 7805 have no component body. / designators have different font size and are not aligned. / Switch designator missing. It seems that many footprints overlap silkscreen to solder pads. / Pin 1 should be indicated in any connector. Touch pads are too big and could have a hole to solder a cable. / Positive and negative pads for battery look the same (they should have slikscreen marks and different shape) / confirm if we can pass through holes of TCRT5000 / S1 has the wrong footprint (it's the middle contact the one that connects / battery pads can be moved around for better ground | Zander's update: / Changed TIP122&L7805CV footprint / Changed resister to PTH / Romain's Suggestions: leave the ground pin first, use ground plane to connect them later / / Rudi: what's the status on the above notes? / is switch footprint correct? I corrected the SCH with wrong connections to GND
tSilk: .